# EasyEDA Pro project ProPrj_ODrive_2025-02-24.epro, board ODrive2_1
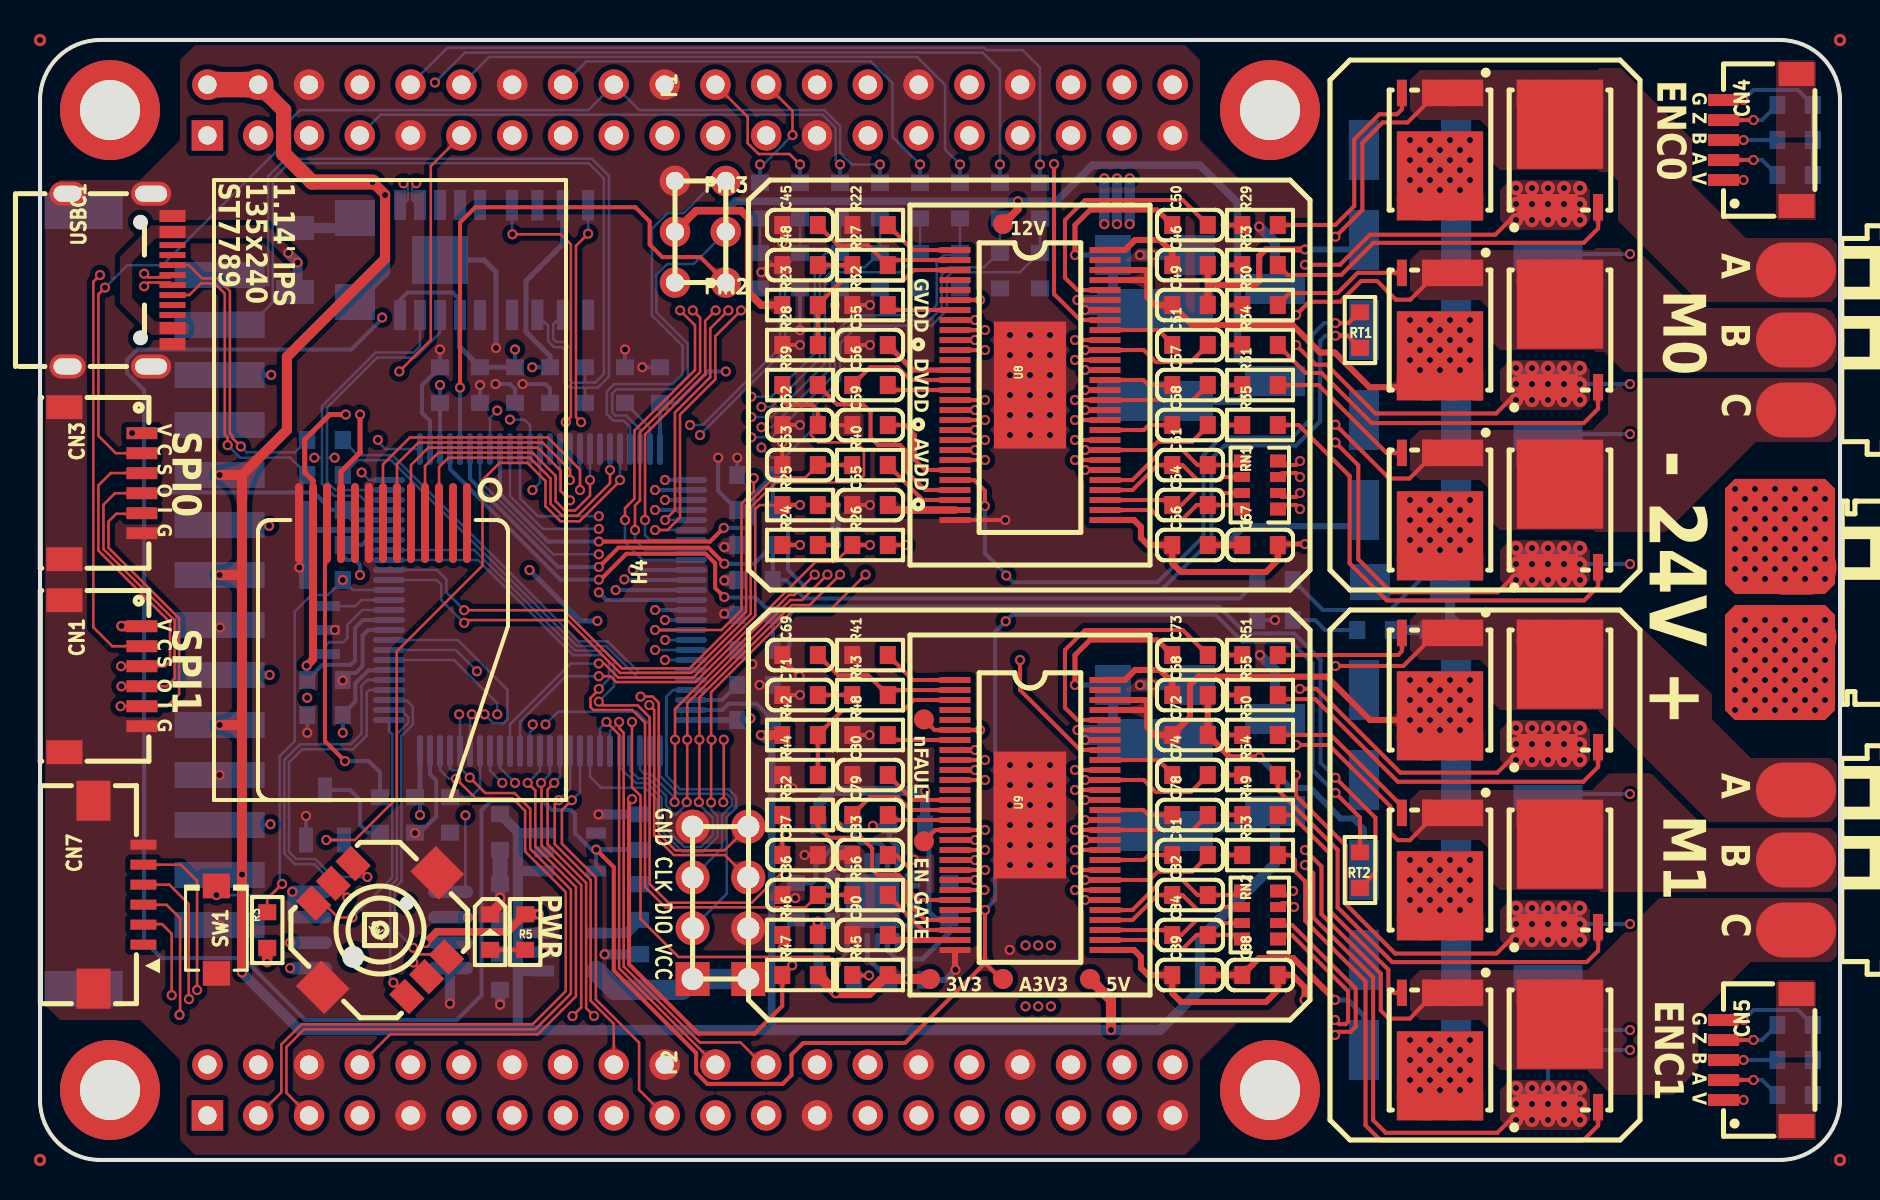
[diagram p11: board, top side]
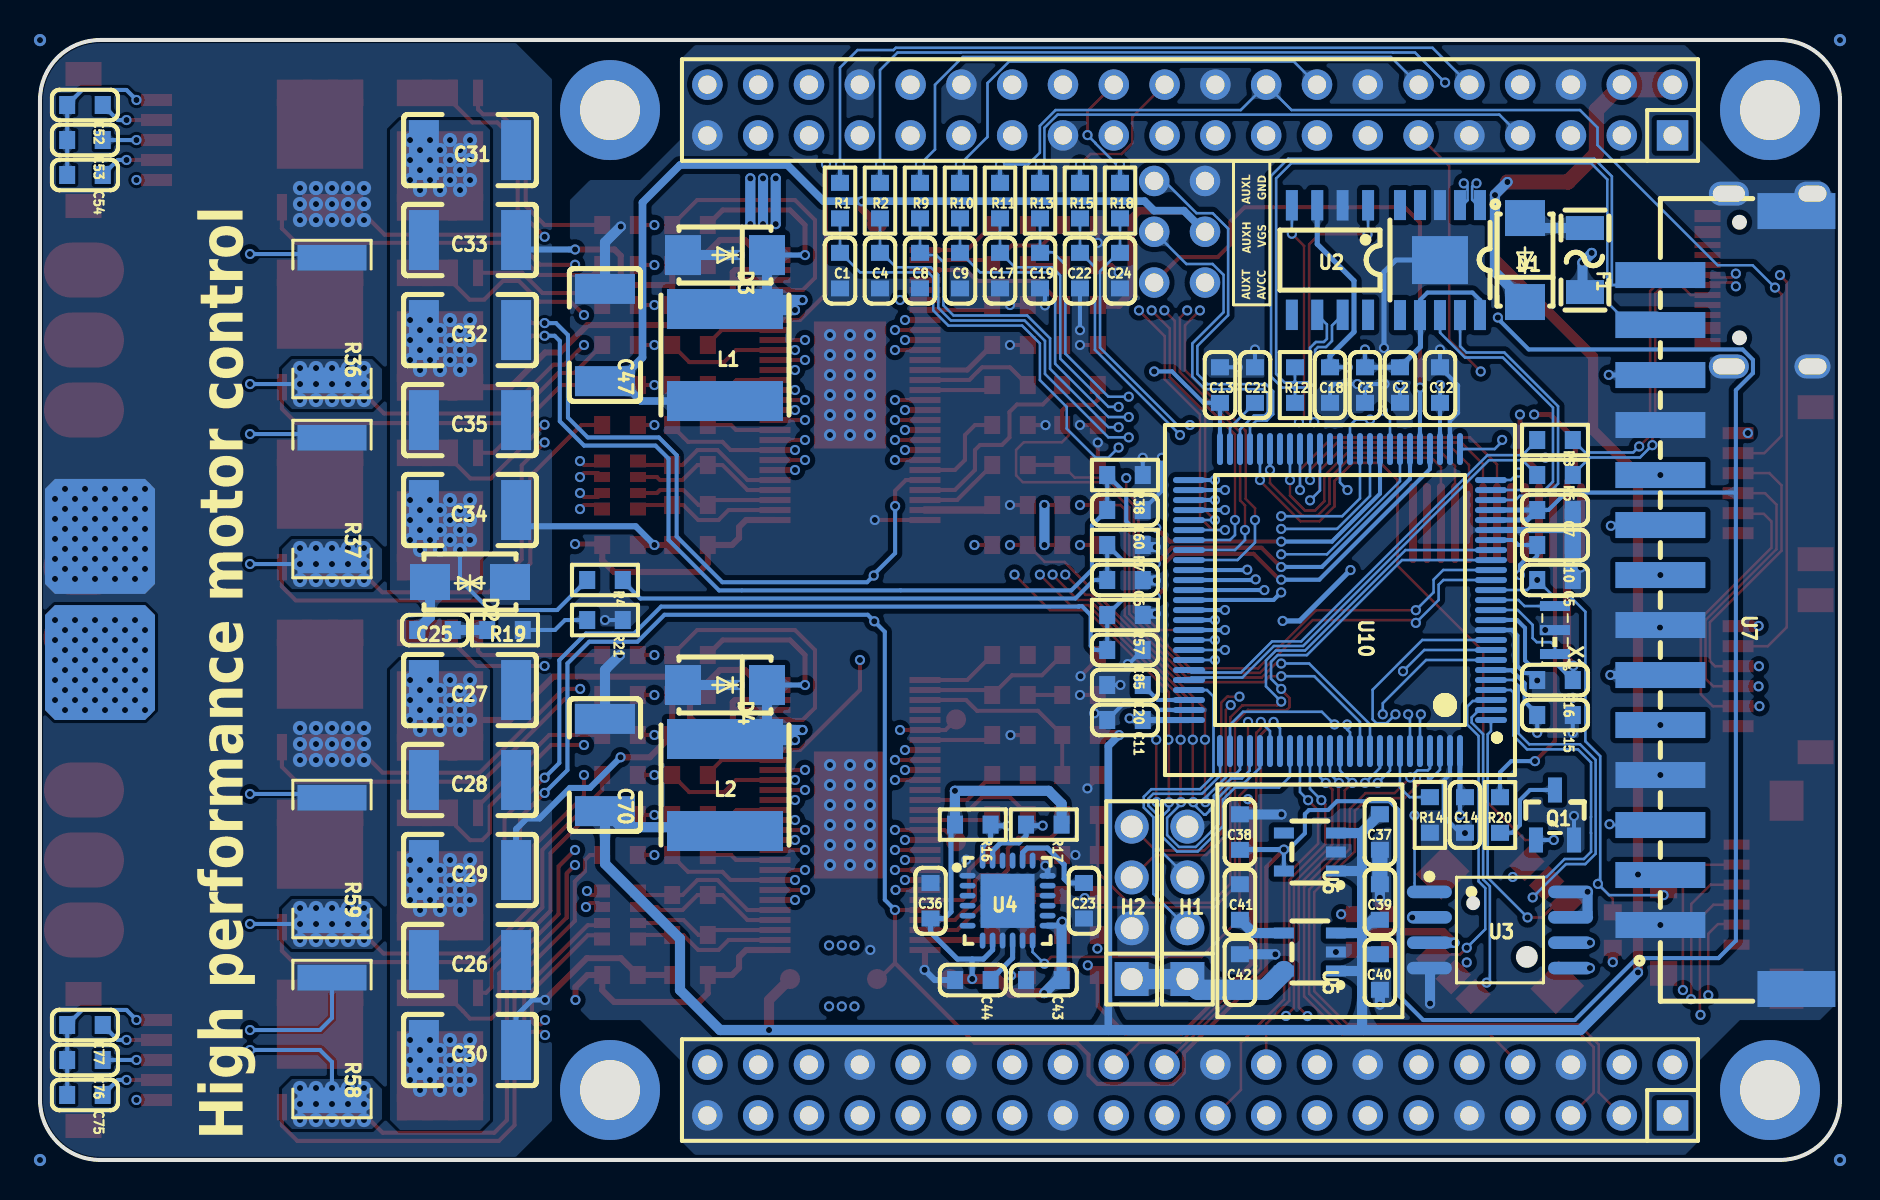
[diagram p12: board, bottom side, seen from below]

Outline 90 x 56 mm; copper layers: Top Layer, Inner1, Inner2, Bottom Layer. Coordinates in mm from the lower left corner of the outline.
Outline path: 0,53 arc(0.88,55.12) 3,56 87,56 arc(89.12,55.12) 90,53 90,3 arc(89.12,0.88) 87,0 3,0 arc(0.88,0.88) 0,3 0,53
Stack: Top Layer 0.035mm / Dielectric1 0.48mm PP er 4.5 / Inner1 0.035mm / Dielectric2 0.48mm FR4 er 4.5 / Inner2 0.035mm / Dielectric3 0.48mm PP er 4.5 / Bottom Layer 0.035mm

## Design rules (mm)
template: 用户自定义配置
spacing Default (default): track to track 0.102, other pairs 0 to 0.102
track width Default (default): min 0.102, default 0.102, max 25.4
differential pair differentialPair (default): width min 0.127, default 0.254, max 2.54; gap min 0.152, default 0.152
via Default (default): diameter min 0.508, default 0.508, max 100.025; hole min 0.305, default 0.305, max 59.995
pour e1 uses gge36994
pour e3 uses gge16096
pour e7 uses gge36994(1)
pour e13 uses gge16096(1)
pour e2511 uses gge36994(2)
pour e2521 uses gge117911
pour e2523 uses gge117915
pour e2525 uses gge117920
pour e2527 uses gge118000
pour e2529 uses gge118003
pour e2531 uses gge118007
pour e3506 uses gge16096(2)
pour e3446 uses gge36994(3)

## Placement (name value [footprint] x y rotation side)
C1  82pF  [C0603]  50 44.47 270 bottom
C2  100nF  [C0603]  22 38.75 90 bottom
C3  1uF  [C0603]  23.75 38.75 90 bottom
C4  82pF  [C0603]  48 44.47 270 bottom
C5  100nF  [C0603]  14.25 29 0 bottom
C6  2.2uF  [C0603]  35.75 29 0 bottom
C7  100nF  [C0603]  14.25 32.5 0 bottom
C8  82pF  [C0603]  46 44.47 270 bottom
C9  82pF  [C0603]  44 44.47 270 bottom
C10  100nF  [C0603]  14.25 30.75 0 bottom
C11  100nF  [C0603]  35.75 22 180 bottom
C12  100nF  [C0603]  20 38.75 270 bottom
C13  100nF  [C0603]  31 38.75 270 bottom
C14  100nF  [C0603]  18.75 17.25 90 bottom
C15  100nF  [C0603]  14.25 22.25 0 bottom
C16  100nF  [C0603]  14.25 24 180 bottom
C17  82pF  [C0603]  42 44.47 270 bottom
C18  100nF  [C0603]  25.5 38.75 90 bottom
C19  82pF  [C0603]  40 44.47 270 bottom
C20  2.2uF  [C0603]  35.75 23.75 180 bottom
C21  2.2uF  [C0603]  29.25 38.75 270 bottom
C22  82pF  [C0603]  38 44.47 270 bottom
C23  2.2nF  [C0603]  37.8 12.96 270 bottom
C24  82pF  [C0603]  36 44.47 270 bottom
C25  100nF  [C0603]  70.25 26.5 0 bottom
C26  47uF  [C1812]  68.5 10 180 bottom
C27  47uF  [C1812]  68.5 23.5 180 bottom
C28  47uF  [C1812]  68.5 19 180 bottom
C29  47uF  [C1812]  68.5 14.5 180 bottom
C30  47uF  [C1812]  68.5 5.5 180 bottom
C31  47uF  [C1812]  68.5 50.5 180 bottom
C32  47uF  [C1812]  68.5 41.5 180 bottom
C33  47uF  [C1812]  68.5 46 180 bottom
C34  47uF  [C1812]  68.5 32.5 180 bottom
C35  47uF  [C1812]  68.5 37 180 bottom
C36  100nF  [C0603]  45.47 12.96 90 bottom
C37  1uF  [C0603]  23 16.4 90 bottom
C38  1uF  [C0603]  30 16.39 270 bottom
C39  10uF  [C0603]  23 12.9 270 bottom
C40  100nF  [C0603]  23 9.4 90 bottom
C41  22nF  [C0603]  30 12.9 270 bottom
C42  10uF  [C0603]  30 9.4 270 bottom
C43  100nF  [C0603]  39.81 9 180 bottom
C44  100nF  [C0603]  43.36 9 180 bottom
C45  6.8pF  [C0603]  38 46.75 0 top
C46  3.3nF  [C0603]  57.5 44.75 180 top
C47  47uF  [C1812]  61.75 41.25 270 bottom
C48  5.1nF  [C0603]  38 44.75 0 top
C49  2.2uF  [C0603]  57.5 42.75 180 top
C50  100nF  [C0603]  57.5 46.75 180 top
C51  100nF  [C0603]  57.5 40.75 0 top
C52  40nF  [C0603]  87.75 52.75 180 bottom
C53  40nF  [C0603]  87.75 51 180 bottom
C54  40nF  [C0603]  87.75 49.25 180 bottom
C55  2.2uF  [C0603]  41.5 40.75 0 top
C56  22nF  [C0603]  41.5 38.75 0 top
C57  100nF  [C0603]  57.5 38.75 0 top
C58  100nF  [C0603]  57.5 36.75 0 top
C59  2.2uF  [C0603]  41.5 36.75 180 top
C60  2.2uF  [C0603]  35.75 32.5 0 bottom
C61  2.2nF  [C0603]  57.5 34.75 0 top
C62  2.2nF  [C0603]  38 36.75 0 top
C63  2.2nF  [C0603]  38 34.75 0 top
C64  2.2nF  [C0603]  57.5 32.75 0 top
C65  2.2uF  [C0603]  41.5 32.75 0 top
C66  100nF  [C0603]  57.5 30.75 180 top
C67  4.7uF  [C0603]  61 30.75 0 top
C68  6.8nF  [C0603]  57.5 23.25 180 top
C69  6.8pF  [C0603]  38 25.25 0 top
C70  47uF  [C1812]  61.75 19.75 270 bottom
C71  4.7nF  [C0603]  38 23.25 0 top
C72  2.2uF  [C0603]  57.5 21.25 180 top
C73  100nF  [C0603]  57.5 25.25 180 top
C74  100nF  [C0603]  57.5 19.25 180 top
C75  40nF  [C0603]  87.75 3.25 180 bottom
C76  40nF  [C0603]  87.75 5 180 bottom
C77  40nF  [C0603]  87.75 6.75 180 bottom
C78  100nF  [C0603]  57.5 17.25 180 top
C79  22nF  [C0603]  41.5 17.25 0 top
C80  2.2uF  [C0603]  41.5 19.25 0 top
C81  100nF  [C0603]  57.5 15.25 180 top
C82  2.2nF  [C0603]  57.5 13.25 0 top
C83  2.2uF  [C0603]  41.5 15.25 180 top
C84  2.2nF  [C0603]  57.5 11.25 0 top
C85  2.2uF  [C0603]  35.75 25.5 0 bottom
C86  2.2nF  [C0603]  38 13.25 0 top
C87  2.2nF  [C0603]  38 15.25 180 top
C88  4.7uF  [C0603]  61 9.25 0 top
C89  100nF  [C0603]  57.5 9.25 180 top
C90  2.2uF  [C0603]  41.5 11.25 0 top
CN1  M1010RS-06P  [CONN-SMD_M1010RS-06P]  3.16 24.19 270 top
CN3  M1010RS-06P  [CONN-SMD_M1010RS-06P]  3.16 33.84 270 top
CN4  M1010RS-05P  [CONN-SMD_M1010RS-05P]  86 51 270 top
CN5  M1010RS-05P  [CONN-SMD_M1010RS-05P]  86 5 270 top
CN7  FPC09-Q1.0-6AH2.0  [FPC-SMD_6P-P1.00_XYECONN_FPC09-Q1.0-6AH2.0]  3.97 13.26 90 top
D1  SS34  [SMA_L4.4-W2.8-LS5.4-RD]  15.75 45 90 bottom
D2  SMAJ30CA  [SMA_L4.4-W2.6-LS5.0-BI]  68.5 28.9 180 bottom
D3  SS34  [SMA_L4.4-W2.8-LS5.4-RD]  55.75 45.25 0 bottom
D4  SS34  [SMA_L4.4-W2.8-LS5.4-RD]  55.75 23.75 0 bottom
F1  FSMD012-1206-R  [F1206]  12.75 45 270 bottom
H1  -  [HDR-TH_4P-P2.54-V-M]  32.63 12.86 90 bottom
H2  -  [HDR-TH_4P-P2.54-V-M]  35.41 12.86 90 bottom
H3  -  [XT30U-M]  87.82 27.86 270 top
H4  -  [MoonGrt]  31 28 270 top
H5  -  [MR30-M]  87.8 41 270 top
H6  -  [MR30-M]  87.8 15 270 top
L1  120uH  [IND-SMD_L6.0-W6.0]  55.75 40.25 270 bottom
L2  22uH  [IND-SMD_L6.0-W6.0]  55.75 18.75 270 bottom
LED1  YLED0603B  [LED0603_BLUE]  22.5 11.39 90 top
NOREF  -  [Pad_e6219]  3.5 52.5 270 top
NOREF#2  -  [Pad_e2533]  87 31.18 0 top
NOREF#3  -  [Pad_e3508]  87 31.18 0 top
NOREF#4  -  [Pad_e2534]  87 24.87 0 top
NOREF#5  -  [Pad_e6221]  3.5 3.5 270 top
NOREF#6  -  [Pad_e3509]  87 24.87 0 top
NOREF#7  -  [Pad_e6220]  61.5 52.5 270 top
NOREF#8  -  [Pad_e6222]  61.5 3.5 270 top
P1  2.54-2*20P母  [MY_HDR-TH_40P-P2.54-V-M-R2-C20-S2.54]  32.5 52.5 0 top
P2  2.54-2*20P母  [MY_HDR-TH_40P-P2.54-V-M-R2-C20-S2.54]  32.5 3.5 0 top
PIN1  -  [1PIN]  31.75 46.41 0 top
PIN2  -  [1PIN]  34.29 43.87 0 top
PIN3  -  [1PIN]  34.29 48.95 0 top
PIN4  -  [1PIN]  34.29 46.41 0 top
PIN5  -  [1PIN]  31.75 48.95 0 top
PIN6  -  [1PIN]  31.75 43.87 0 top
Q1  KRC116S-RTK/P  [SOT-23-3_L2.9-W1.6-P1.90-LS2.8-BR]  14.25 17.25 270 bottom
Q2  KNY3406C  [PDFNWB-8L_L6.0-W5.0-P1.27-BL-EP_CON]  70 50.5 180 top
Q3  KNY3406C  [PDFNWB-8L_L6.0-W5.0-P1.27-BL-EP_CON]  70 41.5 180 top
Q4  KNY3406C  [PDFNWB-8L_L6.0-W5.0-P1.27-BL-EP_CON]  70 32.5 180 top
Q5  KNY3406C  [PDFNWB-8L_L6.0-W5.0-P1.27-BL-EP_CON]  76 50.5 0 top
Q6  KNY3406C  [PDFNWB-8L_L6.0-W5.0-P1.27-BL-EP_CON]  76 41.5 0 top
Q7  KNY3406C  [PDFNWB-8L_L6.0-W5.0-P1.27-BL-EP_CON]  76 32.5 0 top
Q8  KNY3406C  [PDFNWB-8L_L6.0-W5.0-P1.27-BL-EP_CON]  70 5.5 180 top
Q9  KNY3406C  [PDFNWB-8L_L6.0-W5.0-P1.27-BL-EP_CON]  70 14.5 180 top
Q10  KNY3406C  [PDFNWB-8L_L6.0-W5.0-P1.27-BL-EP_CON]  70 23.5 180 top
Q11  KNY3406C  [PDFNWB-8L_L6.0-W5.0-P1.27-BL-EP_CON]  76 5.5 0 top
Q12  KNY3406C  [PDFNWB-8L_L6.0-W5.0-P1.27-BL-EP_CON]  76 14.5 0 top
Q13  KNY3406C  [PDFNWB-8L_L6.0-W5.0-P1.27-BL-EP_CON]  76 23.5 0 top
R1  3.3kΩ  [R0603]  50 47.97 270 bottom
R2  3.3kΩ  [R0603]  48 47.97 270 bottom
R3  10kΩ  [R0603]  11.36 11.5 90 top
R4  10kΩ  [R0603]  61.75 29 180 bottom
R5  1kΩ  [R0603]  24.25 11.4 90 top
R6  22Ω  [R0603]  14.25 34.25 180 bottom
R7  1kΩ  [R0603]  35.75 30.75 180 bottom
R8  22Ω  [R0603]  14.25 36 180 bottom
R9  3.3kΩ  [R0603]  46 47.97 270 bottom
R10  3.3kΩ  [R0603]  44 47.97 270 bottom
R11  3.3kΩ  [R0603]  42 47.97 270 bottom
R12  120Ω  [R0603]  27.25 38.75 90 bottom
R13  3.3kΩ  [R0603]  40 47.97 270 bottom
R14  10kΩ  [R0603]  20.5 17.25 270 bottom
R15  3.3kΩ  [R0603]  38 47.97 270 bottom
R16  4.7kΩ  [R0603]  43.36 16.77 0 bottom
R17  4.7kΩ  [R0603]  39.81 16.77 180 bottom
R18  3.3kΩ  [R0603]  36 47.97 270 bottom
R19  3.3Ω  [R0603]  66.75 26.5 0 bottom
R20  10Ω  [R0603]  17 17.25 90 bottom
R21  0Ω  [R0603]  61.75 27 180 bottom
R22  562kΩ  [R0603]  41.5 46.75 180 top
R23  140kΩ  [R0603]  38 42.75 0 top
R24  3.3kΩ  [R0603]  38 30.75 180 top
R25  3.3kΩ  [R0603]  38 32.75 180 top
R26  3.3kΩ  [R0603]  41.5 30.75 180 top
R27  133kΩ  [R0603]  41.5 44.75 180 top
R28  10kΩ  [R0603]  38 40.75 180 top
R29  2.2Ω  [R0603]  61 46.75 180 top
R30  2.2Ω  [R0603]  61 42.75 180 top
R31  2.2Ω  [R0603]  61 38.75 180 top
R32  18kΩ  [R0603]  41.5 42.75 180 top
R33  2.2Ω  [R0603]  61 44.75 180 top
R34  2.2Ω  [R0603]  61 40.75 180 top
R35  2.2Ω  [R0603]  61 36.75 180 top
R36  0.5mΩ  [R2512]  75.4 42.05 270 bottom
R37  0.5mΩ  [R2512]  75.4 33.05 270 bottom
R38  3.3kΩ  [R0603]  35.75 34.25 180 bottom
R39  22Ω  [R0603]  38 38.75 180 top
R40  22Ω  [R0603]  41.5 34.75 180 top
R41  365kΩ  [R0603]  41.5 25.25 180 top
R42  52.3kΩ  [R0603]  38 21.25 0 top
R43  86.6kΩ  [R0603]  41.5 23.25 180 top
R44  10kΩ  [R0603]  38 19.25 180 top
R45  3.3kΩ  [R0603]  41.5 9.25 180 top
R46  3.3kΩ  [R0603]  38 11.25 180 top
R47  3.3kΩ  [R0603]  38 9.25 180 top
R48  18kΩ  [R0603]  41.5 21.25 180 top
R49  2.2Ω  [R0603]  61 17.25 180 top
R50  2.2Ω  [R0603]  61 21.25 180 top
R51  2.2Ω  [R0603]  61 25.25 180 top
R52  22Ω  [R0603]  38 17.25 180 top
R53  2.2Ω  [R0603]  61 15.25 180 top
R54  2.2Ω  [R0603]  61 19.25 180 top
R55  2.2Ω  [R0603]  61 23.25 180 top
R56  22Ω  [R0603]  41.5 13.25 180 top
R57  3.3kΩ  [R0603]  35.75 27.25 180 bottom
R58  0.5mΩ  [R2512]  75.4 6.05 270 bottom
R59  0.5mΩ  [R2512]  75.4 15.05 270 bottom
RN1  100Ω  [RES-ARRAY-SMD_0603-8P-L3.2-W1.6-BL]  61 33.75 90 top
RN2  100Ω  [RES-ARRAY-SMD_0603-8P-L3.2-W1.6-BL]  61 12.25 90 top
RT1  NCP18XH103F03RB  [R0603]  66 41.5 90 top
RT2  NCP18XH103F03RB  [R0603]  66 14.5 90 top
SW1  TS-1088R-02026  [SW-SMD_L3.9-W3.0-P4.45]  8.82 11.51 90 top
SW2  TM-4175-B-B  [SW-SMD_TM-4175-B-B]  17 11.5 315 top
TFT1  焊接式_TFT_1.14_135x240_13pin  [焊接式_TFT_1.14_135X240_13PIN]  17.5 18 270 top
TP1  Testpoint 1.6mm  [TESTPOINT 1.6MM#2]  44.19 15.93 0 top
TP2  Testpoint 1.6mm  [TESTPOINT 1.6MM#2]  44.19 22.03 0 top
TP3  Testpoint 1.6mm  [TESTPOINT 1.6MM#2]  44.5 9.05 0 top
TP4  Testpoint 1.6mm  [TESTPOINT 1.6MM#2]  48.15 9.05 0 top
TP5  Testpoint 1.6mm  [TESTPOINT 1.6MM#2]  52.5 9.05 0 top
TP6  Testpoint 1.6mm  [TESTPOINT 1.6MM]  49.05 46.8 0 top
U1  CH340K  [ESOP-10_L4.9-W3.9-P1.00-LS6.2-BL-EP]  20 45 0 bottom
U2  SN65HVD232DR  [SOIC-8_L5.0-W4.0-P1.27-LS6.0-BL]  25.5 45 0 bottom
U3  W25Q32JVSSIQ  [SOIC-8_L5.3-W5.3-P1.27-LS8.0-BL]  17 11.5 270 bottom
U4  MPU-6050  [QFN-24_L4.0-W4.0-P0.50-BL-EP2.7]  41.57 12.91 180 bottom
U5  RT9193-33GB  [SOT-23-5_L3.0-W1.7-P0.95-LS2.8-BR]  26.5 10.4 180 bottom
U6  LP5907MFX-3.3/NOPB  [SOT-23-5_L3.0-W1.7-P0.95-LS2.8-BR]  26.5 15.4 180 bottom
U7  KH-A2504-14AWB  [CONN-SMD_14P-P2.50_KH-A2504-14AWB]  5.58 28 90 bottom
U8  DRV8301DCAR  [HTSSOP-56_L14.0-W6.0-P0.50-LS8.0-BL]  49.5 38.75 270 top
U9  DRV8301DCAR  [HTSSOP-56_L14.0-W6.0-P0.50-LS8.0-BL]  49.5 17.25 270 top
U10  STM32F405VGT6  [LQFP-100_L14.0-W14.0-P0.50-LS16.0-BL]  25 28 90 bottom
USBC1  TYPE-C-31-M-12  [USB-C_SMD-TYPE-C-31-M-12]  4 44 270 top
X1  8MHz  [OSC-SMD_3P-L3.2-W1.3-P1.20]  14.25 26.5 90 bottom

## Footprints (pads in the part's own frame, mm; a bottom-side part is the same pattern mirrored in y, then rotated)
1PIN
  round 1.524 hole 0.914: 1(0,0)
C0603
  rect 0.8x0.9 smd: 1(-0.889,0) 2(0.889,0)
C1812
  rect 1.5x3 smd: 1(-2.305,0) 2(2.305,0)
CONN-SMD_14P-P2.50_KH-A2504-14AWB
  rect 1.3x4.5 smd: 1(-16.25,3.4) 2(-13.75,3.4) 3(-11.25,3.4) 4(-8.75,3.4) 5(-6.25,3.4) 6(-3.75,3.4) 7(-1.25,3.4) 8(1.25,3.4) 9(3.75,3.4) 10(6.25,3.4) 11(8.75,3.4) 12(11.25,3.4) 13(13.75,3.4) 14(16.25,3.4)
  rect 1.8x3.9 smd: 15(19.45,-3.4) 16(-19.45,-3.4)
CONN-SMD_M1010RS-05P
  rect 0.6x1.55 smd: 1(2,-1.825) 2(1,-1.825) 3(0,-1.825) 4(-1,-1.825) 5(-2,-1.825)
  rect 1.2x1.8 smd: 6(-3.3,1.825) 7(3.3,1.825)
CONN-SMD_M1010RS-06P
  rect 0.6x1.55 smd: 1(-2.5,1.938) 2(-1.5,1.938) 3(-0.5,1.938) 4(0.5,1.938) 5(1.5,1.938) 6(2.5,1.938)
  rect 1.2x1.8 smd: 7(3.8,-1.938) 8(-3.8,-1.938)
ESOP-10_L4.9-W3.9-P1.00-LS6.2-BL-EP
  rect 0.6x1.5 smd: 1(-2,-2.75) 2(-1,-2.75) 3(0,-2.75) 4(1,-2.75) 5(2,-2.75) 6(2,2.75) 7(1,2.75) 8(0,2.75) 9(-1,2.75) 10(-2,2.75)
  rect 2.8x2.4 smd: 11(0,0)
F1206
  rect 1.2x1.9 smd: 1(-1.6,0) 2(1.6,0)
FPC-SMD_6P-P1.00_XYECONN_FPC09-Q1.0-6AH2.0
  rect 0.5x1.3 smd: 1(-2.5,-1.2) 2(-1.5,-1.2) 3(-0.5,-1.2) 4(0.5,-1.2) 5(1.5,-1.2) 6(2.5,-1.2)
  rect 2x1.7 smd: 7(4.7,1.3) 8(-4.7,1.3)
HDR-TH_4P-P2.54-V-M
  rect 1.7x1.7 hole 1.1: 1(-3.81,0)
  round 1.7 hole 1.1: 2(-1.27,0) 3(1.27,0) 4(3.81,0)
HTSSOP-56_L14.0-W6.0-P0.50-LS8.0-BL
  rect 0.3x1.55 smd: 1(-6.75,-3.75) 2(-6.25,-3.75) 3(-5.75,-3.75) 4(-5.25,-3.75) 5(-4.75,-3.75) 6(-4.25,-3.75) 7(-3.75,-3.75) 8(-3.25,-3.75) 9(-2.75,-3.75) 10(-2.25,-3.75) 11(-1.75,-3.75) 12(-1.25,-3.75) 13(-0.75,-3.75) 14(-0.25,-3.75) 15(0.25,-3.75) 16(0.75,-3.75) 17(1.25,-3.75) 18(1.75,-3.75) 19(2.25,-3.75) 20(2.75,-3.75) 21(3.25,-3.75) 22(3.75,-3.75) 23(4.25,-3.75) 24(4.75,-3.75) 25(5.25,-3.75) 26(5.75,-3.75) 27(6.25,-3.75) 28(6.75,-3.75) 29(6.75,3.75) 30(6.25,3.75) 31(5.75,3.75) 32(5.25,3.75) 33(4.75,3.75) 34(4.25,3.75) 35(3.75,3.75) 36(3.25,3.75) 37(2.75,3.75) 38(2.25,3.75) 39(1.75,3.75) 40(1.25,3.75) 41(0.75,3.75) 42(0.25,3.75) 43(-0.25,3.75) 44(-0.75,3.75) 45(-1.25,3.75) 46(-1.75,3.75) 47(-2.25,3.75) 48(-2.75,3.75) 49(-3.25,3.75) 50(-3.75,3.75) 51(-4.25,3.75) 52(-4.75,3.75) 53(-5.25,3.75) 54(-5.75,3.75) 55(-6.25,3.75) 56(-6.75,3.75)
  rect 6.35x3.61 smd: 57(0,0)
IND-SMD_L6.0-W6.0
  rect 2x5.8 smd: 1(-2.3,0) 2(2.3,0)
LED0603_BLUE
  rect 0.8x0.9 smd: 1(-0.889,0) 2(0.888,0)
LQFP-100_L14.0-W14.0-P0.50-LS16.0-BL
  oval 0.3x1.6 smd: 1(-6,-7.55) 2(-5.5,-7.55) 3(-5,-7.55) 4(-4.5,-7.55) 5(-4,-7.55) 6(-3.5,-7.55) 7(-3,-7.55) 8(-2.5,-7.55) 9(-2,-7.55) 10(-1.5,-7.55) 11(-1,-7.55) 12(-0.5,-7.55) 13(0,-7.55) 14(0.5,-7.55) 15(1,-7.55) 16(1.5,-7.55) 17(2,-7.55) 18(2.5,-7.55) 19(3,-7.55) 20(3.5,-7.55) 21(4,-7.55) 22(4.5,-7.55) 23(5,-7.55) 24(5.5,-7.55) 25(6,-7.55) 51(6,7.55) 52(5.5,7.55) 53(5,7.55) 54(4.5,7.55) 55(4,7.55) 56(3.5,7.55) 57(3,7.55) 58(2.5,7.55) 59(2,7.55) 60(1.5,7.55) 61(1,7.55) 62(0.5,7.55) 63(0,7.55) 64(-0.5,7.55) 65(-1,7.55) 66(-1.5,7.55) 67(-2,7.55) 68(-2.5,7.55) 69(-3,7.55) 70(-3.5,7.55) 71(-4,7.55) 72(-4.5,7.55) 73(-5,7.55) 74(-5.5,7.55) 75(-6,7.55)
  oval 1.6x0.3 smd: 26(7.55,-6) 27(7.55,-5.5) 28(7.55,-5) 29(7.55,-4.5) 30(7.55,-4) 31(7.55,-3.5) 32(7.55,-3) 33(7.55,-2.5) 34(7.55,-2) 35(7.55,-1.5) 36(7.55,-1) 37(7.55,-0.5) 38(7.55,0) 39(7.55,0.5) 40(7.55,1) 41(7.55,1.5) 42(7.55,2) 43(7.55,2.5) 44(7.55,3) 45(7.55,3.5) 46(7.55,4) 47(7.55,4.5) 48(7.55,5) 49(7.55,5.5) 50(7.55,6) 76(-7.55,6) 77(-7.55,5.5) 78(-7.55,5) 79(-7.55,4.5) 80(-7.55,4) 81(-7.55,3.5) 82(-7.55,3) 83(-7.55,2.5) 84(-7.55,2) 85(-7.55,1.5) 86(-7.55,1) 87(-7.55,0.5) 88(-7.55,0) 89(-7.55,-0.5) 90(-7.55,-1) 91(-7.55,-1.5) 92(-7.55,-2) 93(-7.55,-2.5) 94(-7.55,-3) 95(-7.55,-3.5) 96(-7.55,-4) 97(-7.55,-4.5) 98(-7.55,-5) 99(-7.55,-5.5) 100(-7.55,-6)
MR30-M
  oval 2.75x4 smd: 1(-3.5,0) 2(0,0) 3(3.5,0)
MY_HDR-TH_40P-P2.54-V-M-R2-C20-S2.54
  rect 1.575x1.524 hole 0.914: 1(-24.13,-1.27)
  round 1.524 hole 0.914: 2(-24.13,1.27) 3(-21.59,-1.27) 4(-21.59,1.27) 5(-19.05,-1.27) 6(-19.05,1.27) 7(-16.51,-1.27) 8(-16.51,1.27) 9(-13.97,-1.27) 10(-13.97,1.27) 11(-11.43,-1.27) 12(-11.43,1.27) 13(-8.89,-1.27) 14(-8.89,1.27) 15(-6.35,-1.27) 16(-6.35,1.27) 17(-3.81,-1.27) 18(-3.81,1.27) 19(-1.27,-1.27) 20(-1.27,1.27) 21(1.27,-1.27) 22(1.27,1.27) 23(3.81,-1.27) 24(3.81,1.27) 25(6.35,-1.27) 26(6.35,1.27) 27(8.89,-1.27) 28(8.89,1.27) 29(11.43,-1.27) 30(11.43,1.27) 31(13.97,-1.27) 32(13.97,1.27) 33(16.51,-1.27) 34(16.51,1.27) 35(19.05,-1.27) 36(19.05,1.27) 37(21.59,-1.27) 38(21.59,1.27) 39(24.13,-1.27) 40(24.13,1.27)
OSC-SMD_3P-L3.2-W1.3-P1.20
  rect 0.5x1.5 smd: 1(-1.2,0) 2(0,0) 3(1.2,0)
Pad_e2533
  custom 0x0 smd: 1(0,0)
Pad_e2534
  custom 0x0 smd: 4(0,0)
Pad_e3508
  custom 0x0 smd far side: 3(0,0)
Pad_e3509
  custom 0x0 smd far side: 2(0,0)
Pad_e6219
  round 5 hole 3: N(0,0)
Pad_e6220
  round 5 hole 3: N(0,0)
Pad_e6221
  round 5 hole 3: N(0,0)
Pad_e6222
  round 5 hole 3: N(0,0)
PDFNWB-8L_L6.0-W5.0-P1.27-BL-EP_CON
  rect 3.048x1.321 smd: 1(-0.635,-2.857)
  rect 0.5x1.321 smd: 2(-0.635,-2.857) 3(0.635,-2.857) 4(1.905,-2.857) 6(0.635,2.857) 7(-0.635,2.857) 8(-1.905,2.857)
  rect 4.318x1.321 smd: 5(0,2.857)
  rect 4.318x3.5 smd: 8(0,0.812)
QFN-24_L4.0-W4.0-P0.50-BL-EP2.7
  rect 2.7x2.7 smd: (-0.044,0.044)
  oval 0.8x0.28 smd: 1(-2.045,1.307) 2(-2.045,0.807) 3(-2.045,0.307) 4(-2.045,-0.193) 5(-2.045,-0.693) 6(-2.045,-1.193) 13(1.956,-1.193) 14(1.956,-0.693) 15(1.956,-0.193) 16(1.956,0.307) 17(1.956,0.807) 18(1.956,1.299)
  oval 0.28x0.8 smd: 7(-1.294,-1.943) 8(-0.794,-1.943) 9(-0.294,-1.943) 10(0.205,-1.943) 11(0.706,-1.943) 12(1.206,-1.943) 19(1.206,2.057) 20(0.706,2.057) 21(0.205,2.057) 22(-0.294,2.057) 23(-0.794,2.057) 24(-1.294,2.057)
R0603
  rect 0.8x0.9 smd: 1(-0.889,0) 2(0.889,0)
R2512
  rect 1.282x3.456 smd: 1(-3.067,0) 2(3.067,0)
RES-ARRAY-SMD_0603-8P-L3.2-W1.6-BL
  rect 0.65x0.8 smd: 1(-1.2,-0.9) 4(1.2,-0.9) 5(1.2,0.9) 8(-1.2,0.9)
  rect 0.5x0.8 smd: 2(-0.4,-0.9) 3(0.4,-0.9) 6(0.4,0.9) 7(-0.4,0.9)
SMA_L4.4-W2.6-LS5.0-BI
  rect 2x1.8 smd: 1(-2,0) 2(2,0)
SMA_L4.4-W2.8-LS5.4-RD
  rect 1.8x2 smd: 1(-2.1,0) 2(2.1,0)
SOIC-8_L5.0-W4.0-P1.27-LS6.0-BL
  rect 0.6x1.52 smd: 1(-1.905,-2.74) 2(-0.635,-2.74) 3(0.635,-2.74) 4(1.905,-2.74) 5(1.905,2.74) 6(0.635,2.74) 7(-0.635,2.74) 8(-1.905,2.74)
SOIC-8_L5.3-W5.3-P1.27-LS8.0-BL
  oval 0.63x2.25 smd: 1(-1.905,-3.53) 2(-0.635,-3.53) 3(0.635,-3.53) 4(1.905,-3.53) 5(1.905,3.53) 6(0.635,3.53) 7(-0.635,3.53) 8(-1.905,3.53)
SOT-23-3_L2.9-W1.6-P1.90-LS2.8-BR
  rect 1.25x0.7 smd: 1(1.25,-0.95) 2(1.25,0.95) 3(-1.25,0)
SOT-23-5_L3.0-W1.7-P0.95-LS2.8-BR
  rect 1x0.55 smd: 1(1.3,-0.95) 2(1.3,0) 3(1.3,0.95) 4(-1.3,0.95) 5(-1.3,-0.95)
SW-SMD_L3.9-W3.0-P4.45
  rect 1.23x1.36 smd: 1(-2.185,0) 2(2.185,0)
SW-SMD_TM-4175-B-B
  rect 1.4x1.1 smd: 1(-3.3,1.4) 2(-3.3,0) 3(-3.3,-1.4) 4(3.3,1.4) 5(3.3,0) 6(3.3,-1.4)
  rect 2x1.8 smd: 7(0,-4.05) 8(0,4.05)
TESTPOINT 1.6MM
  round 1 smd: 1(-0.9,0)
TESTPOINT 1.6MM#2
  round 1 smd: 1(0,0)
USB-C_SMD-TYPE-C-31-M-12
  oval 1.2x2 hole 0.8x1.6: 0(-4.32,1.556) 0(4.32,1.556)
  oval 1.2x1.8 hole 0.8x1.4: 0(-4.32,-2.624) 0(4.32,-2.624)
  rect 0.3x1.3 smd: A1(-3.35,2.623) A4(-2.55,2.623) A5(-1.25,2.623) A6(-0.25,2.623) A7(0.25,2.623) A8(1.25,2.624) A9(2.55,2.623) A12(3.35,2.623) B1(3.05,2.623) B4(2.25,2.623) B5(1.75,2.623) B6(0.75,2.623) B7(-0.75,2.623) B8(-1.75,2.624) B9(-2.25,2.623) B12(-3.05,2.623)
XT30U-M
  oval 2.75x4 smd: 1(-1.778,0) 2(1.722,0)
焊接式_TFT_1.14_135X240_13PIN
  oval 4x0.4 smd: 1(-13.85,3.85) 2(-13.85,3.15) 3(-13.85,2.45) 4(-13.85,1.75) 5(-13.85,1.05) 6(-13.85,0.35) 7(-13.85,-0.35) 8(-13.85,-1.05) 9(-13.85,-1.75) 10(-13.85,-2.45) 11(-13.85,-3.15) 12(-13.85,-3.85) 13(-13.85,-4.55)

## Nets
As in the schematic, except:
GND: C1.2 C2.1 C3.1 C4.2 C5.1 C6.1 C7.1 C8.2 C9.2 C10.1 C11.1 C12.1 C13.1 C14.1 C15.1 C16.1 C17.2 C18.1 C19.2 C20.1 C21.1 C22.2 C23.2 C24.2 C36.2 C37.1 C38.1 C39.1 C40.1 C41.1 C42.1 C43.1 C44.1 C45.1 C47.1 C48.1 C52.1 C53.1 C54.1 C55.1 C59.2 C60.1 C62.1 C63.1 C65.1 C69.1 C70.1 C71.1 C75.1 C76.1 C77.1 C80.1 C83.2 C85.1 C86.1 C87.1 C90.1 CN1.6 CN1.7 CN1.8 CN3.6 CN3.7 CN3.8 CN4.5 CN5.5 CN7.6 CN7.7 CN7.8 D3.2 D4.2 H1.4 H2.2 LED1.2 P1.6 P1.9 P1.14 P1.20 P1.25 P1.30 P1.34 P1.39 P2.6 P2.9 P2.14 P2.20 P2.25 P2.30 P2.34 P2.39 PIN5.1 Q1.2 R7.2 R14.2 R21.2 R22.2 R28.2 R32.2 R38.2 R41.2 R44.2 R48.2 R57.2 SW1.1 SW2.7 SW2.8 TFT1.8 TFT1.13 U1.3 U1.11 U2.2 U3.4 U4. U4.1 U4.9 U4.11 U4.18 U5.2 U6.2 U7.1 U7.4 U7.7 U7.11 U7.15 U7.16 U8.28 U8.57 U9.28 U9.57 U10.10 U10.20 U10.27 U10.74 U10.99 USBC1.0 USBC1.A1 USBC1.A12 USBC1.B1 USBC1.B12 X1.2
PGND: C26.2 C27.2 C28.2 C29.2 C30.2 C31.2 C32.2 C33.2 C34.2 C35.2 C46.1 C49.1 C66.1 C67.1 C68.1 C72.1 C88.1 C89.1 D2.2 H3.1 NOREF#2.1 NOREF#3.3 Q5.1 Q5.2 Q5.3 Q13.1 Q13.2 Q13.3 R19.1 R21.1 R36.1 R37.1 R58.1 R59.1 RN1.1 RN1.3 RN2.1 RN2.3 U8.44 U9.44
DCBUS: C25.2 C26.1 C27.1 C28.1 C29.1 C30.1 C31.1 C32.1 C33.1 C34.1 C35.1 C49.2 C66.2 C67.2 C72.2 C88.2 C89.2 D2.1 H3.2 NOREF#4.4 NOREF#6.2 Q2.5 Q2.6 Q2.7 Q2.8 Q3.5 Q3.6 Q3.7 Q3.8 Q4.5 Q4.6 Q4.7 Q4.8 Q8.5 Q8.6 Q8.7 Q8.8 Q9.5 Q9.6 Q9.7 Q9.8 Q10.5 Q10.6 Q10.7 Q10.8 R4.1 U8.29 U8.53 U8.54 U9.29 U9.53 U9.54

Pads without a net: CN4 6 7; CN5 6 7; NOREF N; NOREF#7 N; NOREF#8 N; P1 1 3 5 13 15 17 27 29 31 32 33 35 36 37 38 40; P2 1 2 4 7 10 11 12 13 15 16 17 21 23 26 27 28 29 31 32 33 35 36 37 38 40; TFT1 1 2 9; U1 4 5 6; U2 5 8; U4 2 3 4 5 6 7 14 15 16 17 19 21 22; U6 4; U8 4 5 12 55; U9 4 5 12 55; U10 39 44; USBC1 A5 A8 B5 B8

## Via types
v1: diameter 0.61, hole 0.305, Top Layer to Bottom Layer, 40 vias
v2: diameter 0.711, hole 0.305, Top Layer to Bottom Layer, 316 vias
v3: diameter 0.508, hole 0.305, Top Layer to Bottom Layer, 390 vias

## Routing (per net, layer and track width the routed paths; a pad name or vN(x,y) marks a point on that pad's centre or on a via; arc(x,y) is an arc through that point)
5V: length 168.6
  Top Layer w0.508: R42.1 37.1,21.24 v3(36.04,21.24) ; v3(8.98,34.25) 10.1,34.25 10.1,34.25 ; 10.1,21.75 10.1,21.75 v3(8.98,21.75) ; 10.1,21.75 10.1,29.25 ; 10.1,21.75 v3(10.1,14.27) v3(10.1,9.38) ; 10.1,29.25 10.1,34.25 ; 10.1,29.25 10.1,29.25 v3(8.98,29.25) ; 10.1,34.25 12.34,36.5 12.34,40.16 17.25,45.06 17.25,48.27 v3(16.63,48.9) ; TP5.1 53.55,8 v3(53.55,6.5)
  Top Layer w0.762: v3(16.63,48.9) 13.6,48.9 12.18,50.32 12.18,52.5 P1.4
  Top Layer w1.27: P1.4 P1.2
  Bottom Layer w0.381: 36.56,6.5 36.58,6.52 36.58,20.7 v3(36.04,21.24)
  Bottom Layer w0.508: 23.9,11.47 23.36,12.01 23,12.01 ; 23.9,11.47 23.9,14.44 ; 23.9,11.47 23.9,6.56 23.83,6.5 ; 23.9,14.44 23.9,16.35 ; 23.9,14.44 23.9,14.45 U6.1 ; 23.9,16.35 23.9,16.39 C37.2 ; 23.9,16.35 U6.3 ; 23.83,6.5 12.98,6.5 v3(10.1,9.38) ; 23.83,6.5 v3(53.55,6.5) 56,6.5 58,8.5 58,11.06 61.75,14.81 61.75,17.44 60.95,16.64 55.94,16.64 55.75,16.45 ; 15.75,42.9 17.25,44.4 17.25,48.27 v3(16.63,48.9) ; U5.3 23.9,11.35 ; U5.1 23.96,9.45
  Bottom Layer w0.762: C40.2 23.68,10.28
  vias: v3(17.25,48.24)
12V: length 58.2
  Top Layer w0.381: PIN1.1 32.8,47.47 35.05,47.47 35.43,47.08 35.43,43.37 36.05,42.75 37.11,42.75 ; v3(48.9,47.94) 48.9,47.54 TP6.1
  Bottom Layer w0.381: 61.05,38.94 61.05,38.94 61.75,38.94 ; 61.05,38.94 60.95,38.94 59.95,37.95 55.75,37.95 ; 61.05,38.94 61.75,38.94 ; 61.05,38.94 59.87,40.12 59.87,47.87 58,49.75 52.62,49.75 50.82,47.94 34.77,47.94 34.29,47.47 32.81,47.47 PIN1.1
AVCC: length 228.5
  Top Layer w0.203: 47.25,9.84 47.25,12.5 ; 47.25,9.84 43.25,5.85 38.16,5.85 37.57,5.26 37.57,4.25 37.13,3.8 33.37,3.8 32.81,4.37 32.81,5.35 28.69,9.47 28.69,14.64 v3(27.81,15.52) ; 47.25,9.84 48.05,9.05 TP4.1 ; v3(47.24,32.7) 47.24,33.46 46.71,34 45.75,34 ; 45.75,12.5 47.25,12.5 ; 64.77,41.84 65.41,41.84 66,42.44 ; 66,15.39 66,17.12 64.77,18.35
  Inner1 w0.203: v3(48.29,26.94) 48.31,26.96 v3(48.31,29.22) 48.34,29.25 ; 31.75,43.87 29.28,43.87 28.3,44.86 21.36,44.86 18.63,42.12 v3(17.11,42.12)
  Bottom Layer w0.203: 5.21,33.33 5.21,33.33 5.25,33.37 13.7,33.37 14.58,32.5 15.14,32.5 ; 64.77,41.84 64.2,41.84 63.6,41.25 63.6,37.12 62.61,36.13 59.06,36.13 58.17,35.24 58.17,31.17 55.88,28.89 48.65,28.89 v3(48.31,29.22) ; 64.77,18.35 63.63,19.49 63.63,24.82 62.54,25.91 60.12,25.91 58.78,27.26 48.61,27.26 v3(48.29,26.94) 47.76,26.41 47.76,13.01 47.25,12.5 ; v3(27.81,15.52) 27.57,15.52 26.75,16.33 26.75,17.29 26.55,17.5 25.59,17.5 25.15,17.94 22.52,17.94 22.07,17.49 22.07,8.23 20.84,7 13.26,7 10.16,10.09 6.07,10.09 5.21,10.96 5.21,38.49 4.35,39.34 4.35,40.01 4.87,40.53 15.57,40.53 16.95,41.91 16.95,41.97 v3(17.11,42.12) ; v3(47.24,32.7) 47.24,30.34 48.34,29.25 ; U6.5 27.8,15.51 27.81,15.52
  Bottom Layer w0.254: 17.45,32 15.64,32 15.14,32.5 17.45,32.5 ; v3(27.81,15.52) 29.99,15.52 C38.2
  vias: v3(47.25,12.5) v3(64.77,41.84) v3(64.77,18.35)
GND: length 197.4
  Top Layer w0.203: C90.1 40.61,11.25 40.87,11.25 ; 84.18,7 v3(85.18,7) ; v3(36.07,44.38) 36.43,44.75 37.11,44.75 ; 37.11,13.25 37.27,13.09 v3(37.76,13.09) ; 84.18,53 v3(85.18,53) ; 37.11,23.25 v3(38,23.25) ; 40.61,32.75 v3(41.5,32.75) ; C55.1 v3(41.5,40.75) ; 37.22,40.75 R28.2 37.11,40.86 37.22,40.75 ; 37.22,40.75 37.27,40.7 ; 37.22,40.75 v3(38,40.75) ; v3(37.97,24.19) 37.11,25.05 37.11,25.25 ; v3(37.11,45.86) 37.11,46.75 ; v3(38.23,15.25) 38.89,15.25 ; 45.75,32 v3(48.26,32) ; 40.61,36.75 v3(39.72,36.75) ; R48.2 40.62,21.24 v3(41.48,21.24) ; v3(37.63,18.58) 37.11,19.09 37.11,19.25 ; 37.11,34.75 v3(37.11,35.87) ; 40.61,42.75 v3(41.5,42.75) ; 37.11,36.75 v3(38,36.75)
  Top Layer w0.305: v3(45.77,9.51) 45.75,9.53 45.75,10.5
  Top Layer w0.508: C83.2 39.95,15.25 39.73,15.03 v3(39.73,14.71) ; LED1.2 23,12.78 v3(23,13.11)
  Inner1 w0.203: 85.18,53 81.78,53 80.59,54.19 68.01,54.19 62.75,48.93 58.93,48.93 P1.39 ; v3(48.48,10.5) 48.57,10.5 49.18,9.89 79.04,9.89 81.93,7 v3(85.18,7)
  Inner2 w0.508: 0.75,28 6.25,28 0.75,28
  Bottom Layer w0.203: 22,37.86 v3(22,38.75) ; 88.64,6.75 88.64,3.25 ; 24.13,38.8 25.27,38.8 25.5,38.57 25.5,37.86 ; 29.25,39.64 v3(29.25,40.53) ; 34.86,25.5 35.57,24.79 v3(35.62,24.79) ; U10.27 19.5,36.95 19.09,37.35 19.09,38.73 20,39.64 v3(20,40.53) ; 23.75,37.86 23.75,38.54 23.5,38.8 22.77,38.8 ; v3(15.14,23.97) 15.14,24.05 15.44,24.35 15.78,24.35 16.13,24.7 16.13,26.22 16.41,26.5 17.45,26.5 ; v3(85.18,53) 85.68,53.5 87.89,53.5 C52.1 ; R21.2 v3(61.75,27) ; 13.3,16 v3(13.3,17.2) ; 88.64,52.75 88.64,49.25 ; C19.2 39.75,43.33 v3(39.75,42.73) ; v3(30.11,39.64) 31,39.64 ; 88.64,6.75 87.89,7.5 85.68,7.5 85.18,7 ; U10.74 34.12,22.5 34.44,22.81 35.82,22.81 36.3,22.33 v3(37.29,22.33) ; v3(33.91,35.11) 33.91,33.45 34.86,32.5 ; v3(35.98,23.75) 36.64,23.75 ; v3(18.75,16.34) 18.98,16.34 19.81,17.17 19.81,18.98 19.5,19.29 19.5,20.45 ; v3(13.36,21.36) 13.36,22.25 ; v3(38,41.49) 38,43.61 ; R38.2 v3(34.86,35.11)
  Bottom Layer w0.254: v3(22.8,40.6) 22.8,44.4 22.2,45 U1.11
  Bottom Layer w0.305: U4.18 39.62,14.6 v3(39.73,14.71) ; v3(45.77,9.51) 45.26,9 44.25,9 ; 13.36,31.5 17.45,31.5
  Bottom Layer w0.508: 61.75,22.05 61.75,24.5 v3(61,25.25) ; 34.86,27.25 34.8,27.31 v3(34.21,27.31) ; C40.1 23,7.77 ; 61.75,43.55 61.75,45.88 v3(60.96,46.67) ; 57.85,23.75 v3(55.62,23.75) v3(55,23.75) ; v3(28.23,10.28) 30,10.28 C42.1 ; v3(34.21,30.64) 34.76,30.64 34.86,30.75 ; v3(27.93,17.28) 30,17.28 C38.1 ; 34.86,29 34.75,29.11 34.62,28.98 v3(34.21,28.98) ; C39.1 v3(23,13.11) ; 57.85,45.25 v3(55.62,45.25) v3(55,45.25) ; 21.03,9.59 20.5,9.59 v3(20.5,7.82)
  Bottom Layer w0.762: 23,15.51 C39.1
  Bottom Layer w0.813: 13.36,29 C7.1
  vias: v1(48.5,41.25) v1(48.5,40.25) v1(48.5,39.25) v1(48.5,38.25) v1(48.5,37.25) v1(48.5,36.25) v1(48.5,19.75) v1(48.5,18.75) v1(48.5,17.75) v1(48.5,16.75) v1(48.5,15.75) v1(48.5,14.75) v1(49.5,41.25) v1(49.5,40.25) v1(49.5,39.25) v1(49.5,38.25) v1(49.5,37.25) v1(49.5,36.25) v1(49.5,19.75) v1(49.5,18.75) v1(49.5,17.75) v1(49.5,16.75) v1(49.5,15.75) v1(49.5,14.75) v1(50.5,41.25) v1(50.5,40.25) v1(50.5,39.25) v1(50.5,38.25) v1(50.5,37.25) v1(50.5,36.25) v1(50.5,19.75) v1(50.5,18.75) v1(50.5,17.75) v1(50.5,16.75) v1(50.5,15.75) v1(50.5,14.75) v3(9,26.62) v3(8.98,19.25) v3(8.98,11.75) v3(12.96,29.62) v3(14.74,26.5) v3(22.77,38.8) v3(23,7.77) v3(24.13,38.8) v3(25.2,10.4) v3(43.69,15.01)
PGND: length 231.7
  Top Layer w0.203: RN2.1 61.9,11.23 62.61,11.23 65.4,8.44 65.4,6.91 65.28,6.79 64.96,6.79 64.75,7 ; RN1.1 62.1,32.75 62.8,32.75 v3(63,32.55) ; 73.8,20 73.5,20 72.87,19.37 68.01,19.37 63.83,23.55 v3(62.99,23.55) ; v3(63,34.15) 62.8,34.35 62.1,34.35 RN1.3 ; v3(52.25,18) 53.25,18 ; 73.8,47 73.5,47 72.76,46.26 66.5,46.26 65,44.76 v3(63.25,44.76) ; RN2.3 62.1,12.85 62.5,12.85 v3(62.7,12.65) ; v3(52.25,39.5) 53.25,39.5
  Top Layer w0.305: C66.1 v3(59.28,30.75) C67.1 ; C72.1 58.39,23.25 ; 58.39,21.25 59.5,20.13 v3(60.97,20.13) 60.98,20.14 ; v3(63.25,45.52) 61.28,45.52 60.96,45.21 60.96,43.95 60.76,43.75 58.39,43.75 ; v3(64.75,8) 62.66,10.09 60.95,10.09 60.11,9.25 58.39,9.25 ; 58.39,42.75 58.39,44.75
  Inner1 w0.203: 52.25,39.5 54.31,39.5 58.77,43.96 59.53,43.96 60.34,44.76 v3(63.25,44.76) ; v3(79.5,6.5) 79.13,6.12 78.16,6.12 75.92,8.36 67.87,8.36 66.27,6.77 64.98,6.77 64.75,7 ; v3(62.99,23.55) 62.99,23.56 60.63,23.56 59.53,22.46 58.77,22.46 54.31,18 v3(52.25,18) ; v3(79.5,45.3) 79.5,42.85 78.77,42.12 73.69,42.12 72.49,40.93 72.49,37.12 71.63,36.25 67.12,36.25 65.97,35.11 64.59,35.11 63.75,35.95 60.79,35.95 60.4,35.56 60.4,34.75 60.8,34.35 62.8,34.35 v3(63,34.15) ; v3(62.7,12.65) 62.5,12.85 61.35,12.85 61,12.5 61,11.48 61.25,11.23 71.3,11.23 72.39,12.32 72.39,13.84 73.47,14.92 78.74,14.92 79.5,15.67 v3(79.5,18.3) ; v3(79.5,36.3) 79.5,34.09 78.77,33.36 73.63,33.36 71.86,35.13 67.64,35.13 64.35,31.85 61,31.85 60.8,32.05 60.8,32.55 61,32.75 62.8,32.75 63,32.55
  Bottom Layer w0.203: 75.4,45.3 v3(79.5,45.3) ; 65.86,26.5 64.25,26.5 63.75,27 R21.1 ; v3(79.5,6.5) 76,6.5 75.4,7.1 75.4,9.3 ; 75.4,18.3 v3(79.5,18.3) ; 75.4,36.3 v3(79.5,36.3)
  Bottom Layer w0.254: 66.19,5.5 66.19,7.2 65.39,8 v3(64.75,8)
  Bottom Layer w0.305: v3(63.25,45.52) 65.72,45.52 66.19,46 ; 66.19,14.5 66.19,16.54 65.66,17.08 65.02,17.08 63.5,18.6 62.5,18.6 v3(60.97,20.13) ; v3(59.28,30.75) 60.21,31.68 66.19,31.68
  vias: v2(73.8,48.6) v2(73.8,47.8) v2(73.8,47) v2(73.8,21.6) v2(73.8,20.8) v2(73.8,20) v2(74.6,48.6) v2(74.6,47.8) v2(74.6,47) v2(74.6,21.6) v2(74.6,20.8) v2(74.6,20) v2(75.4,48.6) v2(75.4,47.8) v2(75.4,47) v2(75.4,21.6) v2(75.4,20.8) v2(75.4,20) v2(76.2,48.6) v2(76.2,47.8) v2(76.2,47) v2(76.2,21.6) v2(76.2,20.8) v2(76.2,20) v2(77,48.6) v2(77,47.8) v2(77,47) v2(77,21.6) v2(77,20.8) v2(77,20) v2(84.75,33.55) v2(84.75,32.55) v2(84.75,31.55) v2(84.75,30.55) v2(84.75,29.55) v2(85.25,33.05) v2(85.25,32.05) v2(85.25,31.05) v2(85.25,30.05) v2(85.25,29.05) v2(85.75,33.55) v2(85.75,32.55) v2(85.75,31.55) v2(85.75,30.55) v2(85.75,29.55) v2(86.25,33.05) v2(86.25,32.05) v2(86.25,31.05) v2(86.25,30.05) v2(86.25,29.05) v2(86.75,33.55) v2(86.75,32.55) v2(86.75,31.55) v2(86.75,30.55) v2(86.75,29.55) v2(87.25,33.05) v2(87.25,32.05) v2(87.25,31.05) v2(87.25,30.05) v2(87.25,29.05) v2(87.75,33.55) v2(87.75,32.55) v2(87.75,31.55) v2(87.75,30.55) v2(87.75,29.55) v2(88.25,33.05) v2(88.25,32.05) v2(88.25,31.05) v2(88.25,30.05) v2(88.25,29.05) v2(88.75,33.55) v2(88.75,32.55) v2(88.75,31.55) v2(88.75,30.55) v2(88.75,29.55) v2(89.25,33.05) v2(89.25,32.05) v2(89.25,31.05) v2(89.25,30.05) v2(89.25,29.05) v3(64.75,7)
VBUS_S: length 46.3
  Top Layer w0.203: v3(27.94,29.65) 28.12,29.83 28.13,29.83 28.92,30.61 33.41,30.61 v3(34.21,29.81)
  Bottom Layer w0.203: v3(27.94,29.65) 25.91,29.65 21.5,34.05 U10.31 ; 60.86,29 60.86,28.95 59.99,28.07 38.23,28.07 37.3,29 36.64,29 36.64,30.75 35.7,29.81 v3(34.21,29.81)
VCC: length 265.6
  Top Layer w0.127: 19.83,9.16 19.38,9.16 v3(18.66,9.88)
  Top Layer w0.203: 38.89,32.75 v3(39.78,32.75) ; R26.1 v3(43.28,30.75) ; 84.18,49 v3(85.18,49) ; 49,25 49,23.5 52,20.5 53.25,20.5 ; 53.25,42 52,42 50.7,43.3 v3(50.7,49.8) ; 84.18,3 v3(85.18,3) ; R24.1 v3(39.78,30.75)
  Top Layer w0.254: 16,37.27 16,35.37 15.05,34.42 15.05,31.85 ; v3(4.61,36.35) 4.61,36.34 5.04,36.34 ; 13.65,31.85 13.65,33.96 13.23,34.38 13.23,36.02 14.49,37.27 v3(15.29,37.27)
  Top Layer w0.381: R5.2 23.38,11.41 19.83,11.41 v3(19.28,10.86)
  Top Layer w0.406: v3(13.33,24.71) 13.65,25.03 13.65,31.85
  Top Layer w0.508: TP3.1 42.59,9.05 R45.1 ; R3.1 v3(11.36,9.89) ; R46.1 v3(38.89,11.91) ; R47.1 v3(39.79,8.34) 41.44,8.34 42.34,9.25 42.39,9.25 ; v3(4.07,26.7) 4.08,26.69 CN1.1 ; R5.2 24.94,12.29
  Inner1 w0.203: v3(43.39,9.05) 48,9.05 48.38,8.67 78.53,8.67 84.2,3 85.18,3 ; v3(85.18,49) 83.34,49 79.78,52.57 68.69,52.57 63.43,47.31 52.71,47.31 49.68,44.28 46.1,44.28 43.28,41.46 v3(43.28,30.75)
  Bottom Layer w0.203: U10.28 C12.2 v3(20,38.75) ; v3(13.33,24.71) 13.33,24.02 C16.2 14.12,24.76 15.53,24.76 15.75,24.97 15.75,26.6 16.14,27 17.45,27 ; 17.45,24.5 17.44,24.48 16.42,24.48 15.77,23.83 15.77,22.93 15.14,22.3 v3(15.14,21.36) ; v3(24.61,39.64) 25.5,39.64 ; v3(34.29,39.43) 33.4,39.43 31.83,37.86 31,37.86 U10.50 ; 20.99,42.38 20.99,43 20.63,43.37 18.37,43.37 17.99,42.99 17.99,42.38 ; v3(16,29.25) 16,29.75 15.75,30 15.35,30 15.14,30.21 15.14,30.75 16.09,30.75 16.33,31 17.45,31 ; v3(23.75,40.53) 23.75,39.64 ; 19,17.25 19,18.14
  Bottom Layer w0.254: 25.5,39.64 25.5,40.2 24.3,41.4 24.3,43.96 26.14,45.79 26.14,47.74 ; 43.39,10.04 42.83,10.04 42.37,10.5 42.37,10.97 ; 43.39,10.04 v3(43.39,9.05) ; 43.39,10.04 44.13,10.04 45.47,11.38 C36.1 44.78,12.07 44.45,12.4 44.45,16.46 44.2,16.72 ; v3(12.62,13.41) 13.96,13.41 13.97,13.4 ; 19,18.14 19,20.45 ; 23.75,39.64 22,39.64 20.97,40.66 20.97,42.43 ; v3(27.87,26.95) 27.02,26.95 v3(24.47,29.5)
  Bottom Layer w0.305: 38.92,11.88 39.08,11.72 U4.13 ; v3(35.52,22.08) 35.44,22 C11.2 U10.75
  Bottom Layer w0.508: R16.2 44.25,16.77 v3(44.25,18.46) 39.56,18.46 38.92,17.81 R17.2 ; v3(39.78,30.75) v3(39.78,32.75) ; v3(12.62,13.41) 12.62,12.33 12.82,12.13 13.97,12.13 ; v3(53.85,46.79) v3(53.85,49.08) ; 21.03,10.86 19.29,10.86 v3(19.28,10.86) ; v3(54.48,46.79) v3(54.48,49.08) ; v3(38.89,11.91) 38.92,11.88 38.92,9 39.14,9 v3(39.79,8.34) ; 53.21,46.79 v3(53.21,49.08)
  Bottom Layer w1.016: H2.1 H1.1 32.09,8.51 C42.2 28.74,8.51 U5.5
  vias: v3(13.36,23.11) v3(16,37.27) v3(19,17.25) v3(24.94,12.29) v3(49,25) v3(49.28,10.73) v3(49.28,7.68) v3(49.91,10.73) v3(49.91,7.68) v3(50.55,10.73) v3(50.55,7.68) v3(53.21,46.79)
(no net):
  vias: v1(0,56) v1(0,0) v1(90,56) v1(90,0)
_GPIO_0: length 38.4
  Bottom Layer w0.127: P1.10 20.37,55.61 47.21,55.61 47.32,55.5 49.12,55.5 50,54.62 v3(50,49.77)
  Bottom Layer w0.203: 50,48.89 v3(50,49.77)
_GPIO_1: length 39.3
  Inner1 w0.127: P1.8 16.92,54.69 18.92,54.69 v3(19.74,53.87)
  Bottom Layer w0.127: v3(48,49.78) 48,54.5 47.12,55.37 43.96,55.37 43.95,55.38 22.36,55.38 22.35,55.37 21.24,55.37 v3(19.74,53.87)
  Bottom Layer w0.203: 48,48.89 48,49.78
_GPIO_2: length 96.6
  Inner1 w0.127: v3(46,49.77) 45.05,48.83 41.77,48.83 39.9,46.95 39.9,44.76 35.85,40.71 31.06,40.71 27.89,43.88 21.77,43.88 16.81,38.92 14.14,38.92 12.54,37.33 12.54,17.81 v3(11.52,16.79)
  Bottom Layer w0.127: v3(46,49.77) 45.25,50.53 45.25,53.76 43.86,55.15 22.45,55.15 P1.12 ; U7.3 11.5,16.75 11.52,16.77 v3(11.52,16.79)
  Bottom Layer w0.203: 46,48.89 v3(46,49.77)
_GPIO_3: length 79.7
  Inner1 w0.127: v3(11.48,24.25) 12.32,25.08 12.32,37.46 14.04,39.18 16.71,39.18 21.66,44.13 28,44.13 31.14,40.99 35.77,40.99 39.64,44.87 39.64,47.06 41.66,49.08 43.31,49.08 v3(44,49.77)
  Bottom Layer w0.127: v3(44,49.77) 42.62,51.15 42.62,53.84 41.55,54.92 27.31,54.92 P1.16
  Bottom Layer w0.203: 44,48.89 44,49.77
  Bottom Layer w0.406: U7.6 11.48,24.25 v3(11.48,24.25)
_GPIO_4: length 57.1
  Top Layer w0.127: v3(3.25,43.62) 2.92,43.29 2.92,36.21 3.79,35.34 CN3.2
  Bottom Layer w0.127: v3(42,49.77) 40.6,49.77 40.01,50.36 40.01,51.71 39.22,52.5 29.96,52.5 P1.18 27.42,52.5 13,52.5 12.12,51.62 12.12,50.75 6.12,44.74 4.37,44.74 3.38,43.75 3.12,43.75 v3(3.25,43.62)
  Bottom Layer w0.203: 42,48.89 42,49.77
_GPIO_5: length 63.8
  Top Layer w0.127: CN1.2 3.61,25.69 2.67,26.63 2.67,43.91 v3(3,44.25)
  Inner1 w0.127: v3(3,44.25) 4.22,44.25 4.94,44.97 9.73,44.97 P1.7
  Bottom Layer w0.127: P1.7 17.03,52.27 39.12,52.27 39.78,51.61 39.78,50 v3(40,49.77)
  Bottom Layer w0.203: 40,48.89 40,49.77
_GPIO_6: length 54.5
  Top Layer w0.127: P1.22 35.38,52.15 35.38,50.84 35.93,50.3 37.47,50.3 v3(38,49.77)
  Inner1 w0.127: v3(11.45,31.71) 12.09,32.34 12.09,37.55 13.94,39.41 16.61,39.41 21.57,44.36 28.09,44.36 31.23,41.22 35.67,41.22 39.41,44.96 39.41,48.36 v3(38,49.77)
  Bottom Layer w0.203: 38,48.89 38,49.78
  Bottom Layer w0.254: U7.9 11.42,31.75 v3(11.45,31.71)
_GPIO_7: length 47.9
  Top Layer w0.127: P1.24 37.62,52.45 v3(37.62,51.25)
  Inner1 w0.127: v3(36,49.77) 36.75,49.77 39.18,47.34 39.18,45.06 35.58,41.45 31.33,41.45 28.19,44.59 21.47,44.59 16.52,39.63 13.85,39.63 13.47,39.25 v3(11.56,39.25)
  Bottom Layer w0.127: v3(36,49.77) 36.17,49.77 37.24,50.84 37.24,50.86 v3(37.62,51.25)
  Bottom Layer w0.203: 36,48.89 v3(36,49.77)
  Bottom Layer w0.254: U7.12 11.55,39.25 v3(11.56,39.25)
_USB_DM: length 15.1
  Top Layer w0.127: v3(10.04,35.68) 9.61,36.11 9.61,36.21 9.49,36.32 9.49,43.45 8.86,44.08 8.1,44.08 7.43,44.75 6.62,44.75
  Bottom Layer w0.127: 13.36,36 12.74,35.38 10.34,35.38 v3(10.04,35.68)
_USB_DP: length 15.3
  Top Layer w0.127: v3(9.38,35.74) 9.38,36.11 9.24,36.25 9.24,43.32 8.73,43.83 8.05,43.83 7.47,43.25 6.62,43.25
  Bottom Layer w0.127: R6.2 13.36,34.26 12.5,35.12 10,35.12 v3(9.38,35.74)
AUX_H: length 17.9
  Bottom Layer w0.127: PIN4.1 32.68,44.8 31.37,44.8 30.82,44.26 30.82,42.39 32.38,40.82 32.38,39.17 31.75,38.54 28.82,38.54 28.61,38.32 28.61,37.38 28.77,37.22 29.31,37.22 30,36.53 30,35.55
AUX_L: length 20.4
  Bottom Layer w0.127: 29.5,35.55 29.5,36.65 29.18,36.97 28.66,36.97 28.34,37.29 28.34,38.43 28.7,38.79 31.62,38.79 32.13,39.3 32.13,40.7 30.59,42.23 30.59,46.57 31.37,47.34 32.17,47.34 33.79,48.95 PIN3.1
AUX_TEMP: length 27.2
  Top Layer w0.203: v3(21,38.62) 21,46.87 21.77,47.64 29.77,47.64 30.48,46.92 30.48,45.78 31.12,45.14 33.02,45.14 34.29,43.87
  Bottom Layer w0.203: U10.30 v3(21,38.62)
BOOT0: length 3.5
  Bottom Layer w0.127: 22,20.45 22,18.62 21.52,18.14 R14.1
CAN_D: length 32.4
  Top Layer w0.127: v3(26.29,36.89) 26.54,37.15 26.54,45.78 26.03,46.29 v3(23.62,46.29)
  Inner1 w0.127: v3(26.29,36.89) 26.54,36.64 26.54,36.12 25.15,34.73 25.15,26.47 v3(20.96,22.28)
  Bottom Layer w0.127: 21,20.45 21,22.24 ; v3(23.62,46.29) 23.6,46.31 23.6,47.74
CAN_H: length 41.8
  Bottom Layer w0.127: 27.25,38.54 27.18,38.62 26.49,38.62 26.25,38.87 ; 25.7,40.65 25.4,40.95 25.4,41.72 24.87,42.26 ; 26.25,38.87 26.25,40.5 26.1,40.65 25.7,40.65 ; 27.25,37.86 27.25,38.54 27.32,38.62 27.9,38.62 28.45,39.17 28.45,49.21 27.59,50.06 12.29,50.06 11.41,49.18 11.41,43.74 10.27,43.74
CAN_L: length 42.6
  Bottom Layer w0.127: U2.6 25.66,41.78 25.66,41.05 25.81,40.9 26.2,40.9 26.28,40.83 26.5,40.61 26.5,38.97 26.6,38.87 27.17,38.87 27.25,38.95 27.32,38.87 27.77,38.87 28.19,39.3 28.19,49.08 27.44,49.83 12.44,49.83 11.63,49.03 11.63,42.88 11.11,42.36 9.11,42.36 ; 27.25,38.95 27.25,39.64
CAN_R: length 29.9
  Top Layer w0.127: v3(27.05,36.89) 26.8,37.15 26.8,45.71 v3(27.41,46.31)
  Inner1 w0.127: v3(21.59,22.28) 25.4,26.09 25.4,34.62 26.8,36.02 26.8,36.64 v3(27.05,36.89)
  Bottom Layer w0.127: 21.5,20.45 21.5,22.19 ; 27.41,47.74 27.41,46.31 27.43,46.29
DCBUS: length 93.3
  Top Layer w0.127: C67.2 61.94,30.8
  Top Layer w0.254: 61.94,30.8 63.25,30.8
  Top Layer w0.305: 55.36,44 55.36,43.14 55.75,42.75 56.61,42.75 57.61,41.75 62.63,41.75 64,40.37 64.74,40.37 66.47,38.64 68.09,38.64 ; 55.36,44 53.25,44 ; 55.36,44 55.36,44.39 55.25,44.5 53.25,44.5 ; 61.89,30.75 61.89,29.99 61.3,29.4 57.05,29.4 56.61,29.83 C66.2 55.4,30.75 55.05,31.1 55.05,31.65 54.7,32 53.25,32 ; 53.25,23 55.25,23 55.36,22.89 55.36,22.5 53.25,22.5 ; v3(63.23,8) 63.23,8.65 62.63,9.25 61.89,9.25 61.89,8.49 61.3,7.9 57.05,7.9 56.61,8.33 56.61,9.25 55.4,9.25 55.05,9.6 55.05,10.15 54.7,10.5 53.25,10.5 ; 55.36,22.5 55.36,21.64 55.75,21.25 56.61,21.25 57.5,22.13 57.5,23.75 57.92,24.17 64.33,24.17 66.5,22 68.5,22
  Inner1 w0.254: 63.25,30.8 67.56,30.8 67.77,31 68.5,31
  Inner1 w0.305: v3(63.23,8) 63.23,6.55 64.78,5 v2(68.5,5)
  Bottom Layer w0.203: v2(69,30.5) 69,29 67.5,27.5 64.14,27.5 62.64,29
  Bottom Layer w0.508: 70.5,29 70.5,27.14 71.14,26.5
  vias: v2(68.5,51) v2(68.5,50) v2(68.5,49) v2(68.5,42) v2(68.5,41) v2(68.5,40) v2(68.5,33) v2(68.5,32) v2(68.5,31) v2(68.5,24) v2(68.5,23) v2(68.5,22) v2(68.5,15) v2(68.5,14) v2(68.5,13) v2(68.5,6) v2(68.5,4) v2(69,50.5) v2(69,49.5) v2(69,48.5) v2(69,41.5) v2(69,40.5) v2(69,39.5) v2(69,32.5) v2(69,31.5) v2(69,23.5) v2(69,22.5) v2(69,21.5) v2(69,14.5) v2(69,13.5) v2(69,12.5) v2(69,5.5) v2(69,4.5) v2(69,3.5) v2(69.5,51) v2(69.5,50) v2(69.5,49) v2(69.5,42) v2(69.5,41) v2(69.5,40) v2(69.5,33) v2(69.5,32) v2(69.5,31) v2(69.5,24) v2(69.5,23) v2(69.5,22) v2(69.5,15) v2(69.5,14) v2(69.5,13) v2(69.5,6) v2(69.5,5) v2(69.5,4) v2(70,50.5) v2(70,49.5) v2(70,48.5) v2(70,41.5) v2(70,40.5) v2(70,39.5) v2(70,32.5) v2(70,31.5) v2(70,30.5) v2(70,23.5) v2(70,22.5) v2(70,21.5) v2(70,14.5) v2(70,13.5) v2(70,12.5) v2(70,5.5) v2(70,4.5) v2(70,3.5) v2(70.5,51) v2(70.5,50) v2(70.5,49) v2(70.5,42) v2(70.5,41) v2(70.5,40) v2(70.5,33) v2(70.5,32) v2(70.5,31) v2(70.5,24) v2(70.5,23) v2(70.5,22) v2(70.5,15) v2(70.5,14) v2(70.5,13) v2(70.5,6) v2(70.5,5) v2(70.5,4) v2(71,50.5) v2(71,49.5) v2(71,48.5) v2(71,41.5) v2(71,40.5) v2(71,39.5) v2(71,32.5) v2(71,31.5) v2(71,30.5) v2(71,23.5) v2(71,22.5) v2(71,21.5) v2(71,14.5) v2(71,13.5) v2(71,12.5) v2(71,5.5) v2(71,4.5) v2(71,3.5) v2(71.5,51) v2(71.5,50) v2(71.5,49) v2(71.5,42) v2(71.5,41) v2(71.5,40) v2(71.5,33) v2(71.5,32) v2(71.5,31) v2(71.5,24) v2(71.5,23) v2(71.5,22) v2(71.5,15) v2(71.5,14) v2(71.5,13) v2(71.5,6) v2(71.5,5) v2(71.5,4) v2(84.75,26.5) v2(84.75,25.5) v2(84.75,24.5) v2(84.75,23.5) v2(84.75,22.5) v2(85.25,27) v2(85.25,26) v2(85.25,25) v2(85.25,24) v2(85.25,23) v2(85.75,26.5) v2(85.75,25.5) v2(85.75,24.5) v2(85.75,23.5) v2(85.75,22.5) v2(86.25,27) v2(86.25,26) v2(86.25,25) v2(86.25,24) v2(86.25,23) v2(86.75,26.5) v2(86.75,25.5) v2(86.75,24.5) v2(86.75,23.5) v2(86.75,22.5) v2(87.25,27) v2(87.25,26) v2(87.25,25) v2(87.25,24) v2(87.25,23) v2(87.75,26.5) v2(87.75,25.5) v2(87.75,24.5) v2(87.75,23.5) v2(87.75,22.5) v2(88.25,27) v2(88.25,26) v2(88.25,25) v2(88.25,24) v2(88.25,23) v2(88.75,26.5) v2(88.75,25.5) v2(88.75,24.5) v2(88.75,23.5) v2(88.75,22.5) v2(89.25,27) v2(89.25,26) v2(89.25,25) v2(89.25,24) v2(89.25,23) v3(63.25,30.8)
EN_GATE: length 71.7
  Top Layer w0.203: v3(47.25,38) 45.75,38 ; U9.16 44.76,16.5 TP1.1 ; 45.75,16.5 v3(47.25,16.5)
  Inner1 w0.127: 47.25,38 46.59,38 45.06,36.46 45.06,29.6 42.95,27.49 38.45,27.49 36.55,29.39 36.55,31.87 34.42,34 v3(31.25,34) 30.51,34 28.36,31.85 28.36,28.04 27.43,27.11 27.43,20.37 27.9,19.91 41.54,19.91 44.95,16.5 47.25,16.5
  Bottom Layer w0.203: 31.25,34 32.55,34
FLASH_NCS: length 24.9
  Inner1 w0.127: v3(21.27,17.23) 20.17,18.33 20.17,22.16 24.89,26.89 24.89,33.23 v3(24.62,33.5)
  Bottom Layer w0.127: U10.38 25,33.87 v3(24.62,33.5) ; 21.03,13.4 21.27,13.64 v3(21.27,17.23)
FREEIO_1: length 20.7
  Top Layer w0.127: v3(26.59,17.99) 26.09,17.49 26.09,15.82 27.79,14.11 27.79,8.02 29.95,5.86 29.95,3.5 P2.19
  Bottom Layer w0.127: v3(26.59,17.99) 27,18.4 27,20.45
FREEIO_2: length 17.2
  Top Layer w0.127: P2.18 28.69,6.8 27.53,7.96 27.53,13.99 25.74,15.79 25.74,17.79 v3(25.93,17.99)
  Bottom Layer w0.127: v3(25.93,17.99) 26.5,18.56 26.5,20.45
FREEIO_5: length 25.7
  Top Layer w0.127: v3(24.38,18.85) 24.76,18.47 24.76,15.68 26.8,13.65 26.8,8.18 24.89,6.28 17.5,6.28 P2.8
  Bottom Layer w0.127: 25,20.45 25,19.47 v3(24.38,18.85)
FREEIO_6: length 35
  Top Layer w0.127: v3(21.49,19.12) 22.26,18.34 23.72,18.34 24.51,17.55 24.51,15.55 26.54,13.52 26.54,8.31 24.76,6.53 13.21,6.53 12.32,5.64 12.32,3.36 P2.5
  Bottom Layer w0.127: v3(21.49,19.12) 21.13,19.48 20.61,19.48 20.5,19.59 20.5,20.45
FREEIO_7: length 35.3
  Top Layer w0.127: P2.3 12.06,3.38 12.06,5.77 13.08,6.79 24.64,6.79 26.29,8.44 26.29,13.39 24.26,15.42 24.26,17.46 23.62,18.09 21.77,18.09 v3(20.8,19.06)
  Bottom Layer w0.127: v3(20.8,19.06) 20.45,19.06 20,19.51 20,20.45
FREEIO_8: length 23.1
  Top Layer w0.127: P2.24 36.13,4.77 35.02,5.87 32.99,5.87 29.18,9.68 29.18,21.36 28.96,21.59 v3(28.96,21.9)
  Bottom Layer w0.127: v3(28.96,21.9) 28.5,21.45 28.5,20.45
FREEIO_9: length 21
  Top Layer w0.127: P2.22 28.96,9.58 28.96,21.27 v3(28.32,21.9)
  Bottom Layer w0.127: 28,20.45 28,21.58 v3(28.32,21.9)
FREEIO_10: length 30.4
  Top Layer w0.127: v3(31.25,32) 31.75,32.49 31.75,37.37 33.51,39.14 33.51,41.57 v3(34.42,42.48)
  Inner1 w0.127: 35.24,44.1 35.24,43.49 ; 35.24,44.1 35.24,44.67 35.25,44.68 35.25,51.87 35.75,52.37 40,52.37 41.39,53.77 ; 35.24,44.1 35.25,44.09 35.25,43.49 35.24,43.49 ; 35.24,43.49 35.24,43.3 v3(34.42,42.48) ; 35.24,43.48 35.24,43.49
  Bottom Layer w0.127: 31.25,32 U10.55
FREEIO_11: length 24.2
  Top Layer w0.127: v3(35.05,42.48) 33.77,41.19 33.77,39.03 32,37.27 32,32.12 31.38,31.5 v3(30.75,31.5)
  Inner1 w0.127: 36.31,51.23 35.5,50.42 35.5,44.57 35.5,44.57 35.5,44.2 35.5,44.2 35.5,42.93 v3(35.05,42.48)
  Bottom Layer w0.127: v3(30.75,31.5) U10.56
FREEIO_12: length 30.6
  Top Layer w0.127: v3(33.78,42.48) 33.26,41.95 33.26,39.29 30.25,36.28 v3(30.25,32)
  Inner1 w0.127: v3(33.78,42.48) 33.27,42.99 33.27,49.52 33.83,50.07 34.58,50.07 34.93,50.42 34.93,51.92 35.84,52.84 37.92,52.84 38.85,53.77
  Bottom Layer w0.127: 30.25,32 30.25,31.25 30.5,31 U10.57
FREEIO_13: length 25.2
  Top Layer w0.127: v3(32.64,42.48) 33,42.11 33,39.39 30,36.38 30,32.98 29.75,32.73 v3(29.75,31.5)
  Inner1 w0.127: 33.77,51.23 33,50.46 33,42.84 v3(32.64,42.48)
  Bottom Layer w0.127: v3(29.75,31.5) 29.75,31 30.25,30.5 U10.58
FREEIO_14: length 26.7
  Top Layer w0.127: v3(32,42.48) 32.75,41.73 32.75,39.5 29.72,36.47 29.72,33.06 29.25,32.59 v3(29.25,32)
  Inner1 w0.127: v3(32,42.48) 32.75,43.22 32.75,49.71 31.23,51.23
  Bottom Layer w0.127: 29.25,32 29.25,30.87 30.12,30 U10.59
GPIO_0: length 64.7
  Inner1 w0.127: v3(36.07,35.62) 34.53,35.62 32.25,37.9 26.67,37.9 24.01,35.24 18.63,35.24 16.88,33.5 14.7,33.5 14.1,34.1 14.1,34.73 v3(13.72,35.11)
  Bottom Layer w0.127: v3(13.72,35.11) 14.1,35.11 ; 14.1,35.11 14.1,33.81 14.7,33.21 16,33.21 16.21,33 17.45,33 ; 14.1,35.11 14.1,37.69 16.78,40.37 18.68,40.37 18.99,40.69 18.99,42.38 ; 36.07,35.62 36.58,35.11 37.21,35.11 38.66,36.56 38.66,37.65 40,38.99 40,40.83 40.9,41.72 44.58,41.72 45.34,42.48 45.34,44.13 45.59,44.38 48.99,44.38 50,45.39 50,47.11
GPIO_1: length 60.6
  Inner1 w0.127: v3(14.73,35.11) 14.35,34.73 14.35,34.24 14.84,33.75 16.78,33.75 18.52,35.5 23.9,35.5 26.56,38.15 32.36,38.15 34.38,36.13 35.56,36.13
  Bottom Layer w0.127: 14.35,35.11 v3(14.73,35.11) ; 14.35,35.11 14.35,37.62 16.86,40.12 18.75,40.12 19.99,41.36 19.99,42.38 ; 14.35,35.11 14.35,33.92 14.77,33.5 17.45,33.5 ; v3(35.56,36.13) 36.58,36.13 39.75,39.3 39.75,40.95 40.77,41.97 44.45,41.97 45.09,42.61 45.09,44.25 45.47,44.63 47.2,44.63 47.95,45.39 48,45.39 48,47.11
GPIO_2: length 41.4
  Inner1 w0.127: v3(36.07,36.64) 34.23,36.64 32.46,38.4 26.46,38.4 23.8,35.75 18.42,35.75 17.04,34.37 16.08,34.37
  Bottom Layer w0.127: 36.07,36.64 36.58,36.64 39.5,39.56 39.5,41.08 40.64,42.23 44.32,42.23 44.83,42.73 44.83,44.89 45.19,45.25 45.86,45.25 46,45.39 46,47.11 ; 17.45,34 16.45,34 16.08,34.37
  vias: v3(16.08,34.37)
GPIO_3: length 38.8
  Inner1 w0.127: 35.56,37.15 34.08,37.15 32.57,38.66 26.35,38.66 23.69,36 v3(16.89,36)
  Bottom Layer w0.127: 19,35.55 17.27,35.55 16.89,35.92 v3(16.89,36) ; 44,47.11 44,45.39 42.99,44.38 39.53,44.38 39.24,44.09 39.24,39.81 36.58,37.15 v3(35.56,37.15)
GPIO_4: length 30.8
  Inner1 w0.127: v3(22.86,37.47) 22.86,36.89 23.24,36.51 23.84,36.51 26.25,38.91 32.67,38.91 33.93,37.65 v3(36.07,37.65)
  Bottom Layer w0.127: U10.33 22.5,37.1 22.86,37.46 v3(22.86,37.47) ; 42,47.11 42,45.39 41.25,44.63 39.4,44.63 38.99,44.23 38.99,40.07 36.58,37.66 36.07,37.66
GPIO_5: length 27.4
  Inner1 w0.127: 35.56,38.16 33.78,38.16 32.77,39.18 26.15,39.18 23.99,37.02 v3(23.5,37.02)
  Bottom Layer w0.127: v3(35.56,38.16) 36.58,38.16 38.73,40.32 38.73,44.76 39.36,45.39 40,45.39 40,47.11 ; v3(23.5,37.02) 24.21,37.02 24.5,36.73 U10.37
GPIO_6: length 41.7
  Inner1 w0.127: v3(25.27,21.77) 25.91,22.41 25.91,34.41 28.88,37.39 31.13,37.39 32.27,36.25 v3(33,36.25)
  Bottom Layer w0.127: 38,47.11 38,45.39 37.25,44.64 37.25,40.51 33,36.26 v3(33,36.25) ; 25.27,21.77 25.91,22.41 29.84,22.41 30.5,21.75 30.5,20.45
GPIO_7: length 36.1
  Inner1 w0.127: v3(32.5,36.75) 32.13,36.75 31.23,37.64 28.78,37.64 25.65,34.52 25.65,22.79 v3(24.64,21.77)
  Bottom Layer w0.127: 24.5,20.45 24.5,20.45 24.5,21.38 24.64,21.52 24.64,21.78 ; v3(32.5,36.75) 33.13,36.75 37,40.61 37,44.44 36.05,45.39 36,45.39 36,47.11
GPIO_8: length 43.6
  Top Layer w0.127: v3(25.71,18.85) 25.38,18.52 25.38,15.78 27.3,13.86 27.3,7.6 v3(27.7,7.2) ; v3(7.85,8.49) 7.85,13.95 7.04,14.76 CN7.5
  Inner1 w0.127: v3(7.85,8.49) 7.85,8.44 8.95,7.35 25.86,7.35 26.19,7.67 27.23,7.67 v3(27.7,7.2)
  Bottom Layer w0.127: U10.86 26,19.14 v3(25.71,18.85)
GPIO_9: length 41.5
  Top Layer w0.127: CN7.4 6.47,13.76 7.44,12.8 7.44,8.05 v3(7.45,8.04) ; v3(25.05,18.85) 25.08,18.83 25.08,15.73 27.06,13.75 27.06,7.63 v3(26.63,7.19)
  Inner1 w0.127: v3(26.63,7.19) 26.5,7.07 8.42,7.07 v3(7.45,8.04)
  Bottom Layer w0.127: U10.87 25.5,19.3 v3(25.05,18.85)
GVDD: length 3.9
  Top Layer w0.254: 45.75,39.5 43.64,39.5 C55.2
GVDD2: length 3.9
  Top Layer w0.203: 42.39,19.25 43.64,18 45.75,18
I2C_SCL: length 32.5
  Top Layer w0.127: H2.3 35.36,14.13 34.24,15.25 31.69,15.25 30.71,16.23 30.71,22.5 v3(30.46,22.74)
  Inner1 w0.127: v3(30.46,22.74) 30.44,22.76 30.44,24.89 29.36,25.98 29.36,27.99 29.64,28.27 v3(29.64,29.51)
  Inner1 w0.254: v3(39.87,16.72) 39.87,15.63 38.36,14.13 H2.3
  Bottom Layer w0.203: v3(29.64,29.51) 29.65,29.5 U10.60
  Bottom Layer w0.254: v3(39.87,16.72) 40.65,16.72 R17.1 40.7,16.21 41.05,15.86 41.97,15.86 42.37,15.45 42.37,14.97
I2C_SDA: length 32.1
  Top Layer w0.127: H2.4 34.22,15.47 31.78,15.47 30.94,16.32 30.94,22.86 30.63,23.17 v3(30.03,23.17)
  Inner1 w0.127: v3(29.22,29.03) 29.22,28.17 29.13,28.08 29.13,25.88 29.13,25.88 29.13,25.82 30.03,24.93 v3(30.03,23.17)
  Inner1 w0.254: H2.4 36.03,17.28 41.08,17.28 v3(41.65,16.71)
  Bottom Layer w0.203: v3(29.22,29.03) 29.25,29 U10.61
  Bottom Layer w0.254: v3(41.65,16.71) 42.41,16.71 R16.1 42.47,16.06 42.87,15.66 42.87,14.97
M0_AH: length 44.1
  Top Layer w0.203: 45.75,37.5 v3(46.75,37.5)
  Inner1 w0.127: 48.2,34.4 48.2,35.39 ; 48.2,34.4 48.2,35.39 ; 48.2,34.4 46.58,32.78 ; 48.2,34.4 46.58,32.78 ; 48.2,35.39 48,35.59 ; 48.2,35.39 48,35.59 ; 46.58,28.97 46.58,32.78 ; 46.58,28.97 46.58,32.78 ; 46.58,28.97 43.58,25.97 33.52,25.97 31.34,28.15 30.48,28.15 30.04,27.7 30.04,26.57 30.61,26 v3(31.25,26) ; 47.38,37.5 48,36.87 ; 47.38,37.5 46.75,37.5 47.38,37.5 ; 47.38,37.5 48,36.87 ; 48,36.87 48,35.59 ; 48,36.87 48,35.59
  Bottom Layer w0.127: 31.25,26 32.55,26
